# EAGLE design busfahrer_pi (EAGLE 6.2)
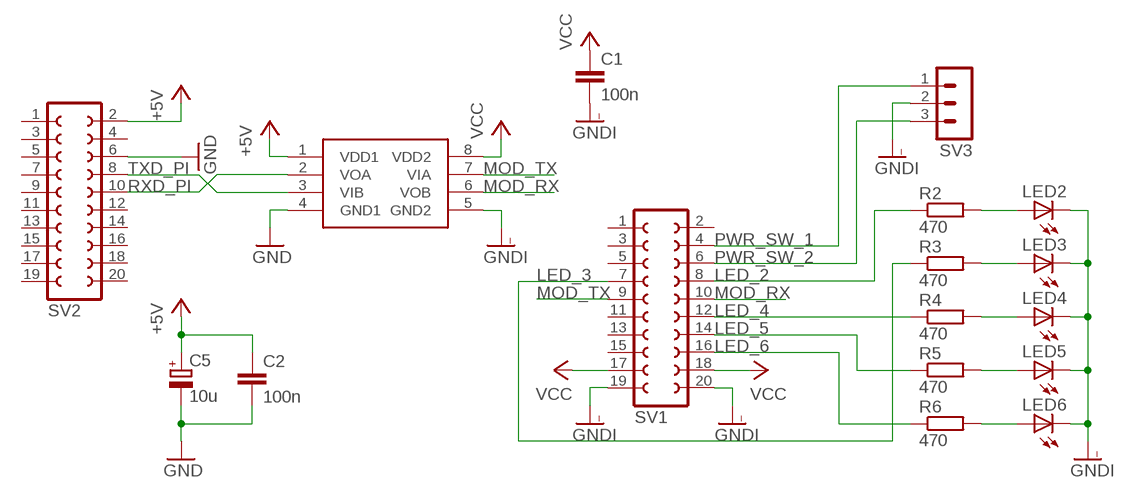
[diagram p0: schematic, sheet 1]

## Parts
C1  100n  C-EUC0805  [C0805]
C2  100n  C-EUC0805  [C0805]
C5  10u  CPOL-EUE1.8-4  [E1,8-4]
LED2  LEDCHIPLED_0805  [CHIPLED_0805]
LED3  LEDCHIPLED_0805  [CHIPLED_0805]
LED4  LEDCHIPLED_0805  [CHIPLED_0805]
LED5  LEDCHIPLED_0805  [CHIPLED_0805]
LED6  LEDCHIPLED_0805  [CHIPLED_0805]
R2  470  R-EU_R0805  [R0805]
R3  470  R-EU_R0805  [R0805]
R4  470  R-EU_R0805  [R0805]
R5  470  R-EU_R0805  [R0805]
R6  470  R-EU_R0805  [R0805]
SV1  FE10-2  [FE10-2]
SV2  FE10-2  [FE10-2]
SV3  MA03-1  [MA03-1]
U$1  ADUM3211  [SO8]

## Nets
+5V: C2.1 C5.+ SV2.2 U$1.1(VDD1)
GND: C2.2 C5.- SV2.6 U$1.4(GND1)
GNDI: C1.2 LED2.C LED3.C LED4.C LED5.C LED6.C SV1.19 SV1.20 SV3.2 U$1.5(GND2)
LED_2: R2.1 SV1.8
LED_3: R3.1 SV1.7
LED_4: R4.1 SV1.12
LED_5: R5.1 SV1.14
LED_6: R6.1 SV1.16
MOD_RX: SV1.10 U$1.6(VOB)
MOD_TX: SV1.9 U$1.7(VIA)
N$8: LED2.A R2.2
N$9: LED3.A R3.2
N$10: LED4.A R4.2
N$11: LED5.A R5.2
N$12: LED6.A R6.2
PWR_SW_1: SV1.4 SV3.1
PWR_SW_2: SV1.6 SV3.3
RXD_PI: SV2.10 U$1.2(VOA)
TXD_PI: SV2.8 U$1.3(VIB)
VCC: C1.1 SV1.17 SV1.18 U$1.8(VDD2)
Unconnected: SV1.1 SV1.2 SV1.3 SV1.5 SV1.11 SV1.13 SV1.15 SV2.1 SV2.3 SV2.4 SV2.5 SV2.7 SV2.9 SV2.11 SV2.12 SV2.13 SV2.14 SV2.15 SV2.16 SV2.17 SV2.18 SV2.19 SV2.20

## Library data of the parts
C1 C2 = rcl:C-EU: CAPACITOR, European symbol
C5 = rcl:CPOL-EU: POLARIZED CAPACITOR, European symbol
LED2-LED6 = led:LED: LED OSRAM: - CHIPLED LG R971, LG N971, LY N971, LG Q971, LY Q971, LO R971, LY R971 LH N974, LH R974 LS Q976, LO Q976, LY Q976 LO Q996 - Hyper CHIPLED LW Q18S LB Q993, LB Q99A, LB R99A - SideLED LS A670, LO A670, LY A670, LG A670, LP A670 LB A673, LV A673, LT A673, LW A673 LH A674 LY A675 LS A676, LA A676, LO A676, LY A676, LW A676 LS A679, LY A679, LG A679 - Hyper Micro SIDELED® LS Y876, LA Y876, LO Y876, LY Y876 LT Y87S - SmartLED LW L88C, LW L88S LB L89C, LB L89S, LG L890 LS L89K, LO L89K, LY L89K LS L896, LA L896, LO L896, LY L896 - TOPLED LS T670, LO T670, LY T670, LG T670, LP T670 LSG T670, LSP T670, LSY T670, LOP T670, LYG T670 LG T671, LOG T671, LSG T671 LB T673, LV T673, LT T673, LW T673 LH T674 LS T676, LA T676, LO T676, LY T676, LB T676, LH T676, LSB T676, LW T676 LB T67C, LV T67C, LT T67C, LS T67K, LO T67K, LY T67K, LW E67C LS E67B, LA E67B, LO E67B, LY E67B, LB E67C, LV E67C, LT E67C LW T67C LS T679, LY T679, LG T679 LS T770, LO T770, LY T770, LG T770, LP T770 LB T773, LV T773, LT T773, LW T773 LH T774 LS E675, LA E675, LY E675, LS T675 LS T776, LA T776, LO T776, LY T776, LB T776 LHGB T686 LT T68C, LB T68C - Hyper Mini TOPLED® LB M676 - Mini TOPLED Santana® LG M470 LS M47K, LO M47K, LY M47K Source: http://www.osram.convergy.de LUXEON: - LUMILED® LXK2-PW12-R00, LXK2-PW12-S00, LXK2-PW14-U00, LXK2-PW14-V00 LXK2-PM12-R00, LXK2-PM12-S00, LXK2-PM14-U00 LXK2-PE12-Q00, LXK2-PE12-R00, LXK2-PE12-S00, LXK2-PE14-T00, LXK2-PE14-U00 LXK2-PB12-K00, LXK2-PB12-L00, LXK2-PB12-M00, LXK2-PB14-N00, LXK2-PB14-P00, LXK2-PB14-Q00 LXK2-PR12-L00, LXK2-PR12-M00, LXK2-PR14-Q00, LXK2-PR14-R00 LXK2-PD12-Q00, LXK2-PD12-R00, LXK2-PD12-S00 LXK2-PH12-R00, LXK2-PH12-S00 LXK2-PL12-P00, LXK2-PL12-Q00, LXK2-PL12-R00 Source: www.luxeon.com KINGBRIGHT: KA-3528ASYC Source: www.kingbright.com
R2-R6 = rcl:R-EU_: RESISTOR, European symbol
SV1 SV2 = con-lsta:FE10-2: FEMALE HEADER; OC_FARNELL: unknown; OC_NEWARK: unknown
SV3 = con-lstb:MA03-1: PIN HEADER; OC_FARNELL: unknown; OC_NEWARK: unknown
U$1 = adum3211:ADUM3211

## Board
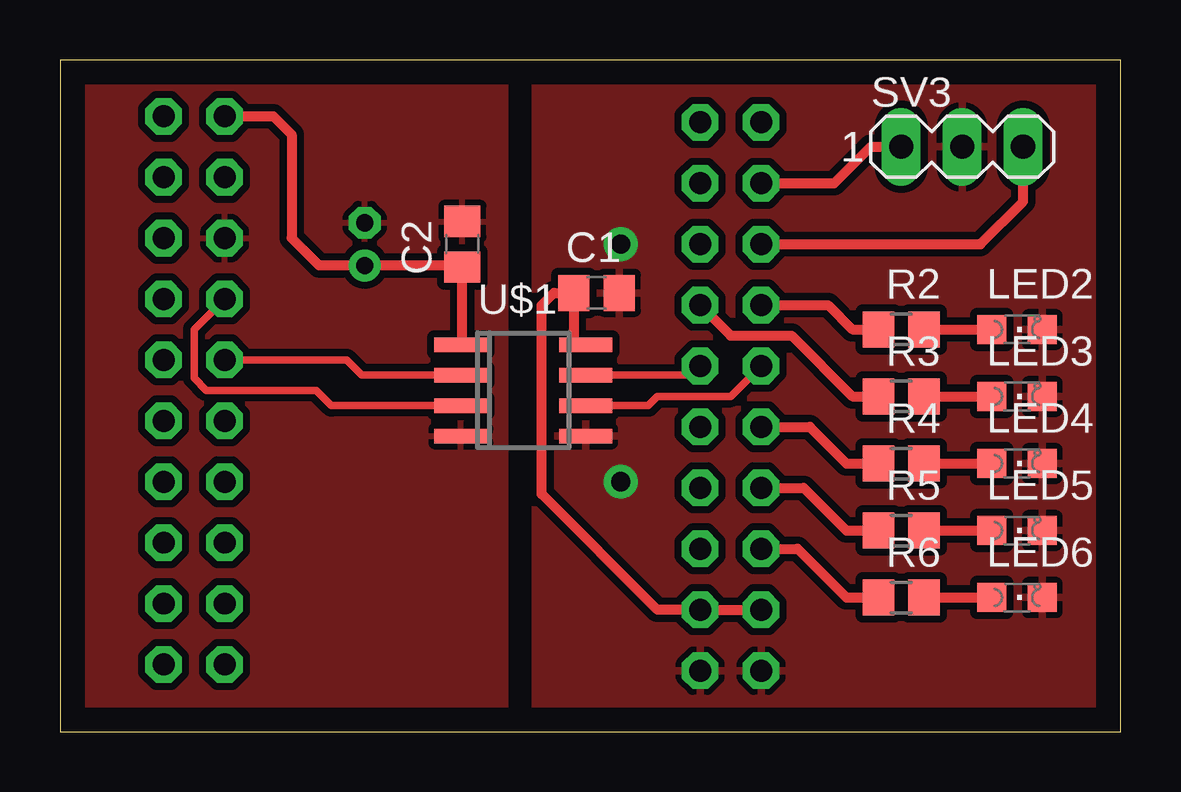
[diagram p1: board, top side]
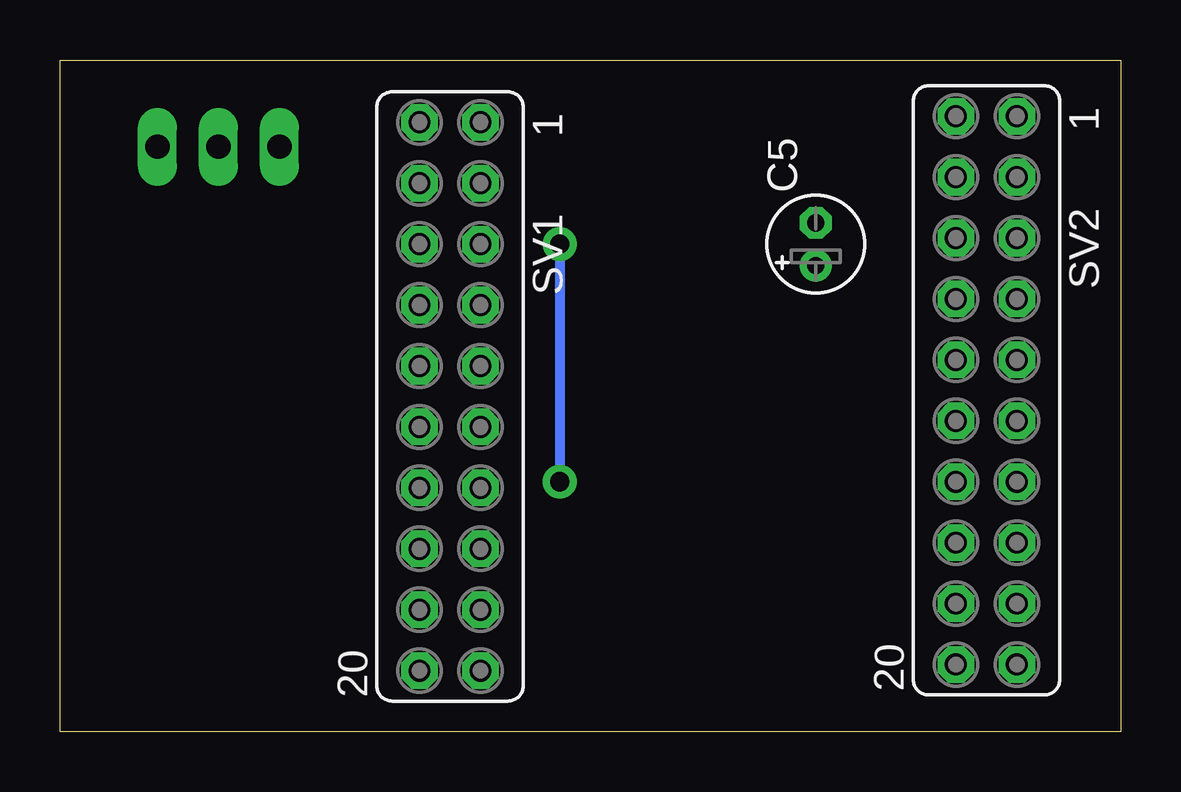
[diagram p2: board, bottom side, seen from below]

Size 44.19 x 28 mm. Coordinates in mm from the lower left corner, seen from the top.
Outline: 0,0 44.19,0 44.19,28 0,28 0,0
Copper layers (1*16): Top 0.035mm / dielectric 1.5mm / Bottom 0.035mm
Design rules: minimum track width 10mil, minimum drill 24mil, track to track 8mil, track to pad 8mil, pad to pad 8mil, via to via 8mil, smd to smd 8mil, copper to edge 40mil, drill to drill 8mil, minimum pad ring 12mil, minimum via ring 12mil, stop-mask expansion 4mil, vias tented up to drill 0mil, thermal gap 10mil

### Footprints (pad centres in the part's own frame; a part is rotated, then mirrored left to right if it is on the bottom)
C0805 = smd 1.3 x 1.5: 1 -0.95,0; 2 0.95,0
E1,8-4 = drill 0.711 pad 1.168: + -0.889,0 | drill 0.711 pad 1.168 octagon: - 0.889,0
CHIPLED_0805 = smd 1.2 x 1.2: A 0,-1.05; C 0,1.05
R0805 = smd 1.3 x 1.5: 1 -0.95,0; 2 0.95,0
FE10-2 = drill 0.914 octagon: 1 -11.43,1.27; 2 -11.43,-1.27; 3 -8.89,1.27; 4 -8.89,-1.27; 5 -6.35,1.27; 6 -6.35,-1.27; 7 -3.81,1.27; 8 -3.81,-1.27; 9 -1.27,1.27; 10 -1.27,-1.27; 11 1.27,1.27; 12 1.27,-1.27; 13 3.81,1.27; 14 3.81,-1.27; 15 6.35,1.27; 16 6.35,-1.27; 17 8.89,1.27; 18 8.89,-1.27; 19 11.43,1.27; 20 11.43,-1.27
MA03-1 = drill 1.016 long: 1 -2.54,0; 2 0,0; 3 2.54,0
SO8 = smd 0.6 x 2.2: 1 -1.905,-2.6; 2 -0.635,-2.6; 3 0.635,-2.6; 4 1.905,-2.6; 5 1.905,2.6; 6 0.635,2.6; 7 -0.635,2.6; 8 -1.905,2.6

### Placement (x,y rotation side)
C1  22.35,18.29 0 top
C2  16.76,20.32 90 top
C5  12.7,20.32 90 bottom
LED2  39.88,16.76 270 top
LED3  39.88,13.97 270 top
LED4  39.88,11.18 270 top
LED5  39.88,8.38 270 top
LED6  39.88,5.59 270 top
R2  35.05,16.76 0 top
R3  35.05,13.97 0 top
R4  35.05,11.18 0 top
R5  35.05,8.38 0 top
R6  35.05,5.59 0 top
SV1  27.94,13.97 270 bottom
SV2  5.59,14.22 270 bottom
SV3  37.59,24.38 0 top
U$1  19.3,14.22 270 top

### Tracks (layer width: path | path; a pad name or v marks a point on that pad's centre or on a via)
+5V
  Top 0.406: U$1.1 16.76,16.13 C2.1 16.7,19.43 C5.+ 10.79,19.43 9.65,20.57 9.65,24.89 8.89,25.65 SV2.2
GND
  pour Top (isolate 0.305): -2.03,29.21 18.54,29.21 18.54,-1.27 -2.29,-1.27
GNDI  (via drill 0.8)
  Bottom 0.406: v23.37,20.32 v23.37,10.41
  pour Top (isolate 0.305): 19.81,28.7 46.23,28.7 46.23,-0.51 19.81,-0.51
LED_2
  Top 0.406: SV1.8 32,17.78 33.02,16.76 R2.1
LED_3
  Top 0.406: SV1.7 27.94,16.51 30.48,16.51 33.02,13.97 R3.1
LED_4
  Top 0.406: SV1.12 31.24,12.7 32.77,11.18 R4.1
LED_5
  Top 0.406: SV1.14 30.99,10.16 32.77,8.38 R5.1
LED_6
  Top 0.406: SV1.16 30.73,7.62 32.77,5.59 R6.1
MOD_RX
  Top 0.305: U$1.6 24.51,13.59 24.89,13.97 27.94,13.97 SV1.10
MOD_TX
  Top 0.305: U$1.7 26.29,14.86 SV1.9
N$8
  Top 0.406: R2.2 LED2.A
N$9
  Top 0.406: R3.2 LED3.A
N$10
  Top 0.406: R4.2 LED4.A
N$11
  Top 0.406: R5.2 LED5.A
N$12
  Top 0.406: R6.2 LED6.A
PWR_SW_1
  Top 0.406: SV1.4 32.26,22.86 33.78,24.38 SV3.1
PWR_SW_2
  Top 0.406: SV1.6 38.35,20.32 40.13,22.1 SV3.3
RXD_PI
  Top 0.305: U$1.2 12.57,14.86 11.94,15.49 SV2.10
TXD_PI
  Top 0.305: U$1.3 11.3,13.59 10.67,14.22 6.1,14.22 5.59,14.73 5.59,16.76 SV2.8
VCC
  Top 0.406: SV1.18 SV1.17 24.89,5.08 20.07,9.91 20.07,17.78 20.57,18.29 C1.1 21.4,16.32 21.34,16.26 21.46,16.13 U$1.8